# Altium schematic sheet InductorLadder.SchDoc
size A4
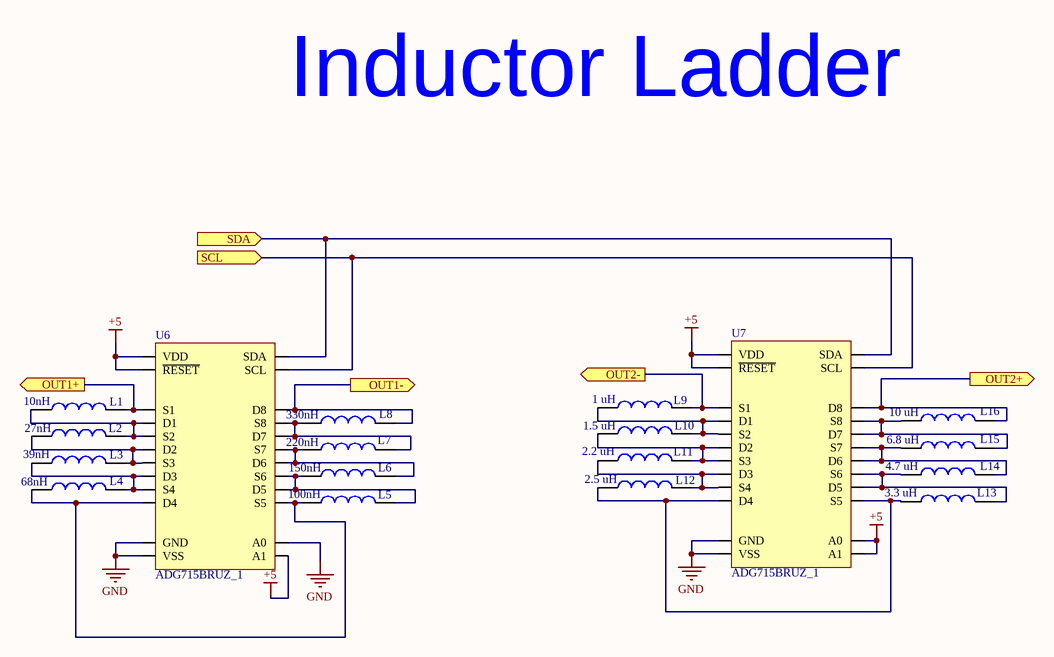
[diagram p0: InductorLadder.SchDoc]

## Parts
L1  value 10nH  [WE-KI_1008A]  (hidden comment: WE-KI, 744762110A)
L2  value 27nH  [WE-KI_1008A]  (hidden comment: WE-KI, 744762127A)
L3  value 39nH  [WE-KI_1008A]  (hidden comment: WE-KI, 744762139A)
L4  value 68nH  [WE-KI_1008A]  (hidden comment: WE-KI, 744762168A)
L5  value 100nH  [WE-KI_1008A]  (hidden comment: WE-KI, 744762210A)
L6  value 150nH  [WE-KI_1008A]  (hidden comment: WE-KI, 744762215A)
L7  value 220nH  [WE-KI_1008A]  (hidden comment: WE-KI, 744762222A)
L8  value 330nH  [WE-KI_1008A]  (hidden comment: WE-KI, 744762233A)
L9  1 uH  [WE-LQS_2010]
L10  1.5 uH  [WE-LQS_2010]
L11  2.2 uH  [WE-LQS_2010]
L12  2.5 uH  [WE-LQS_2010]
L13  3.3 uH  [WE-LQS_2010]
L14  4.7 uH  [WE-LQS_2010]
L15  6.8 uH  [WE-LQS_2010]
L16  10 uH  [WE-LQS_2010]
U6  ADG715BRUZ_1  [ADG715BRUZ]
U7  ADG715BRUZ_1  [ADG715BRUZ]

## Ports
OUT1+ (out), OUT1- (out), OUT2+ (out), OUT2- (out), SCL (in), SDA (in)

## Nets
+5: U6.2(VDD) U6.22(A1) U6.23(~{RESET}) U7.2(VDD) U7.22(A1) U7.23(~{RESET}) U7.24(A0)
GND: U6.4(GND) U6.21(VSS) U6.24(A0) U7.4(GND) U7.21(VSS)
OUT1+: L1.2 U6.5(S1) ; port OUT1+
OUT1-: L8.2 U6.19(D8) ; port OUT1-
OUT2+: L16.2 U7.19(D8) ; port OUT2+
OUT2-: L9.2 U7.5(S1) ; port OUT2-
SCL: U6.1(SCL) U7.1(SCL) ; port SCL
SDA: U6.3(SDA) U7.3(SDA) ; port SDA
NetL1_1: L1.1 L2.2 U6.6(D1) U6.7(S2)
NetL2_1: L2.1 L3.2 U6.8(D2) U6.9(S3)
NetL3_1: L3.1 L4.2 U6.10(D3) U6.11(S4)
NetL4_1: L4.1 L5.1 U6.12(D4) U6.14(S5)
NetL5_2: L5.2 L6.1 U6.13(D5) U6.16(S6)
NetL6_2: L6.2 L7.1 U6.15(D6) U6.18(S7)
NetL7_2: L7.2 L8.1 U6.17(D7) U6.20(S8)
NetL9_1: L9.1 L10.2 U7.6(D1) U7.7(S2)
NetL10_1: L10.1 L11.2 U7.8(D2) U7.9(S3)
NetL11_1: L11.1 L12.2 U7.10(D3) U7.11(S4)
NetL12_1: L12.1 L13.1 U7.12(D4) U7.14(S5)
NetL13_2: L13.2 L14.1 U7.13(D5) U7.16(S6)
NetL14_2: L14.2 L15.1 U7.15(D6) U7.18(S7)
NetL15_2: L15.2 L16.1 U7.17(D7) U7.20(S8)

## Notes on the sheet
- Inductor Ladder
- Title
- Size:
- Date:
- A4
- Number:
- Time:
- Revision:
- Sheet
- of
- File:

## Library data of the parts
L1 = WE-KI, 744762110A: WE-KI SMD Wire Wound Ceramic Inductor, size 1008A, 10nH; PublishedDate: Sep. 2016; Publisher: Wurth Elektronik; ComponentLink1Description: Manufacturer; ComponentLink1URL: http://www.we-online.de; ComponentLink2Description: Datasheet; ComponentLink2URL: http://katalog.we-online.de/pbs/datasheet/744762110A.pdf; PartNumber: 744762110A; Size: 1008A; Supplier 1: Digi-Key; Supplier Part Number 1: 732-1808-6-ND
L2 = WE-KI, 744762127A: WE-KI SMD Wire Wound Ceramic Inductor, size 1008A, 27nH; PublishedDate: Sep. 2016; Publisher: Wurth Elektronik; ComponentLink1Description: Manufacturer; ComponentLink1URL: http://www.we-online.de; ComponentLink2Description: Datasheet; ComponentLink2URL: http://katalog.we-online.de/pbs/datasheet/744762127A.pdf; PartNumber: 744762127A; Size: 1008A; Supplier 1: Digi-Key; Supplier Part Number 1: 732-1813-6-ND
L3 = WE-KI, 744762139A: WE-KI SMD Wire Wound Ceramic Inductor, size 1008A, 39nH; PublishedDate: Sep. 2016; Publisher: Wurth Elektronik; ComponentLink1Description: Manufacturer; ComponentLink1URL: http://www.we-online.de; ComponentLink2Description: Datasheet; ComponentLink2URL: http://katalog.we-online.de/pbs/datasheet/744762139A.pdf; PartNumber: 744762139A; Size: 1008A; Supplier 1: Digi-Key; Supplier Part Number 1: 732-1815-6-ND
L4 = WE-KI, 744762168A: WE-KI SMD Wire Wound Ceramic Inductor, size 1008A, 68nH; PublishedDate: Sep. 2016; Publisher: Wurth Elektronik; ComponentLink1Description: Manufacturer; ComponentLink1URL: http://www.we-online.de; ComponentLink2Description: Datasheet; ComponentLink2URL: http://katalog.we-online.de/pbs/datasheet/744762168A.pdf; PartNumber: 744762168A; Size: 1008A; Supplier 1: Digi-Key; Supplier Part Number 1: 732-1818-6-ND
L5 = WE-KI, 744762210A: WE-KI SMD Wire Wound Ceramic Inductor, size 1008A, 100nH; PublishedDate: Sep. 2016; Publisher: Wurth Elektronik; ComponentLink1Description: Manufacturer; ComponentLink1URL: http://www.we-online.de; ComponentLink2Description: Datasheet; ComponentLink2URL: http://katalog.we-online.de/pbs/datasheet/744762210A.pdf; PartNumber: 744762210A; Size: 1008A; Supplier 1: Digi-Key; Supplier Part Number 1: 732-1820-6-ND
L6 = WE-KI, 744762215A: WE-KI SMD Wire Wound Ceramic Inductor, size 1008A, 150nH; PublishedDate: Sep. 2016; Publisher: Wurth Elektronik; ComponentLink1Description: Manufacturer; ComponentLink1URL: http://www.we-online.de; ComponentLink2Description: Datasheet; ComponentLink2URL: http://katalog.we-online.de/pbs/datasheet/744762215A.pdf; PartNumber: 744762215A; Size: 1008A; Supplier 1: Digi-Key; Supplier Part Number 1: 732-1822-6-ND
L7 = WE-KI, 744762222A: WE-KI SMD Wire Wound Ceramic Inductor, size 1008A, 220nH; PublishedDate: Sep. 2016; Publisher: Wurth Elektronik; ComponentLink1Description: Manufacturer; ComponentLink1URL: http://www.we-online.de; ComponentLink2Description: Datasheet; ComponentLink2URL: http://katalog.we-online.de/pbs/datasheet/744762222A.pdf; PartNumber: 744762222A; Size: 1008A; Supplier 1: Digi-Key; Supplier Part Number 1: 732-1824-6-ND
L8 = WE-KI, 744762233A: WE-KI SMD Wire Wound Ceramic Inductor, size 1008A, 330nH; PublishedDate: Sep. 2016; Publisher: Wurth Elektronik; ComponentLink1Description: Manufacturer; ComponentLink1URL: http://www.we-online.de; ComponentLink2Description: Datasheet; ComponentLink2URL: http://katalog.we-online.de/pbs/datasheet/744762233A.pdf; PartNumber: 744762233A; Size: 1008A; Supplier 1: Digi-Key; Supplier Part Number 1: 732-1826-6-ND
L9 = 74404020010: WE-LQS SMD Power Inductor, size 2010, 1 uH, 1.49 A; Manufacturer: Wurth Electronics; Rated Current max.: 1.49 A; DC Resistance: 0.095 Ohm; ComponentLink1Description: Manufacturer; ComponentLink1URL: http://www.we-online.de; ComponentLink2Description: Datasheet; ComponentLink2URL: http://katalog.we-online.de/pbs/datasheet/74404020010.pdf; Part Number: 74404020010; Published Date: Dec. 2017; Publisher: Wurth Elektronik; Size: 2010; Inductance: 1 uH; Operating Temperature: -40 to +125 degC; Supplier 1: Digi-Key; Manufacturer Part Number: 74404020010; Stock 1: 3959; Supplier Part Number 1: 732-10739-6-ND; Pricing 1: 1=0.56, 50=0.4698, 100=0.357, 1000=0.31007 (USD)
L10 = 74404020015: WE-LQS SMD Power Inductor, size 2010, 1.5 uH, 1.19 A; Manufacturer: Wurth Electronics; Rated Current max.: 1.19 A; DC Resistance: 0.145 Ohm; ComponentLink1Description: Manufacturer; ComponentLink1URL: http://www.we-online.de; ComponentLink2Description: Datasheet; ComponentLink2URL: http://katalog.we-online.de/pbs/datasheet/74404020015.pdf; Part Number: 74404020015; Published Date: Dec. 2017; Publisher: Wurth Elektronik; Size: 2010; Inductance: 1.5 uH; Operating Temperature: -40 to +125 degC; Supplier 1: Digi-Key; Manufacturer Part Number: 74404020015; Stock 1: 3931; Supplier Part Number 1: 732-10740-6-ND; Pricing 1: 1=0.56, 50=0.4698, 100=0.357, 1000=0.31007 (USD)
L11 = 74404020022: WE-LQS SMD Power Inductor, size 2010, 2.2 uH, 0.96 A; Manufacturer: Wurth Electronics; Rated Current max.: 0.96 A; DC Resistance: 0.22 Ohm; ComponentLink1Description: Manufacturer; ComponentLink1URL: http://www.we-online.de; ComponentLink2Description: Datasheet; ComponentLink2URL: http://katalog.we-online.de/pbs/datasheet/74404020022.pdf; Part Number: 74404020022; Published Date: Dec. 2017; Publisher: Wurth Elektronik; Size: 2010; Inductance: 2.2 uH; Operating Temperature: -40 to +125 degC; Supplier 1: Digi-Key; Manufacturer Part Number: 74404020022; Stock 1: 3236; Supplier Part Number 1: 732-10741-6-ND; Pricing 1: 1=0.56, 50=0.4698, 100=0.357, 1000=0.31007 (USD)
L12 = 74405020022: WE-LQS SMD Power Inductor, size 2010, 2.5 uH, 0.96 A; Part Number: 74404020022; Manufacturer: Wurth Electronics; Rated Current max.: 0.96 A; Inductance: 2.2 uH; DC Resistance: 0.22 Ohm; ComponentLink1Description: Manufacturer; ComponentLink1URL: http://www.we-online.de; ComponentLink2Description: Datasheet; ComponentLink2URL: http://katalog.we-online.de/pbs/datasheet/74404020022.pdf; Published Date: Dec. 2017; Publisher: Wurth Elektronik; Size: 2010; Operating Temperature: -40 to +125 degC; Manufacturer Part Number: 74404020022; Supplier 1: Digi-Key; Stock 1: 4000; Supplier Part Number 1: 732-10770-6-ND; Pricing 1: 1=0.63, 50=0.522, 100=0.3967, 1000=0.34451 (USD)
L13 = 74404020033: WE-LQS SMD Power Inductor, size 2010, 3.3 uH, 0.87 A; Manufacturer: Wurth Electronics; Rated Current max.: 0.87 A; DC Resistance: 0.279 Ohm; ComponentLink1Description: Manufacturer; ComponentLink1URL: http://www.we-online.de; ComponentLink2Description: Datasheet; ComponentLink2URL: http://katalog.we-online.de/pbs/datasheet/74404020033.pdf; Part Number: 74404020033; Published Date: Dec. 2017; Publisher: Wurth Elektronik; Size: 2010; Inductance: 3.3 uH; Operating Temperature: -40 to +125 degC; Supplier 1: Digi-Key; Manufacturer Part Number: 74404020033; Stock 1: 3787; Supplier Part Number 1: 732-10742-6-ND; Pricing 1: 1=0.56, 50=0.4698, 100=0.357, 1000=0.31007 (USD)
L14 = 74404020047: WE-LQS SMD Power Inductor, size 2010, 4.7 uH, 0.73 A; Manufacturer: Wurth Electronics; Rated Current max.: 0.73 A; DC Resistance: 0.399 Ohm; ComponentLink1Description: Manufacturer; ComponentLink1URL: http://www.we-online.de; ComponentLink2Description: Datasheet; ComponentLink2URL: http://katalog.we-online.de/pbs/datasheet/74404020047.pdf; Part Number: 74404020047; Published Date: Dec. 2017; Publisher: Wurth Elektronik; Size: 2010; Inductance: 4.7 uH; Operating Temperature: -40 to +125 degC; Supplier 1: Digi-Key; Manufacturer Part Number: 74404020047; Stock 1: 3398; Supplier Part Number 1: 732-10743-6-ND; Pricing 1: 1=0.56, 50=0.4698, 100=0.357, 1000=0.31007 (USD)
L15 = 74404020068: WE-LQS SMD Power Inductor, size 2010, 6.8 uH, 0.56 A; Manufacturer: Wurth Electronics; Rated Current max.: 0.56 A; DC Resistance: 0.68 Ohm; ComponentLink1Description: Manufacturer; ComponentLink1URL: http://www.we-online.de; ComponentLink2Description: Datasheet; ComponentLink2URL: http://katalog.we-online.de/pbs/datasheet/74404020068.pdf; Part Number: 74404020068; Published Date: Dec. 2017; Publisher: Wurth Elektronik; Size: 2010; Inductance: 6.8 uH; Operating Temperature: -40 to +125 degC; Supplier 1: Digi-Key; Manufacturer Part Number: 74404020068; Stock 1: 3558; Supplier Part Number 1: 732-10744-6-ND; Pricing 1: 1=0.56, 50=0.4698, 100=0.357, 1000=0.31007 (USD)
L16 = 74404020100: WE-LQS SMD Power Inductor, size 2010, 10 uH, 0.5 A; Manufacturer: Wurth Electronics; Rated Current max.: 0.5 A; DC Resistance: 0.85 Ohm; ComponentLink1Description: Manufacturer; ComponentLink1URL: http://www.we-online.de; ComponentLink2Description: Datasheet; ComponentLink2URL: http://katalog.we-online.de/pbs/datasheet/74404020100.pdf; Part Number: 74404020100; Published Date: Dec. 2017; Publisher: Wurth Elektronik; Size: 2010; Inductance: 10 uH; Operating Temperature: -40 to +125 degC; Supplier 1: Digi-Key; Manufacturer Part Number: 74404020100; Stock 1: 3185; ComponentLink3URL: http://www.farnell.com/datasheets/2277209.pdf; ComponentLink3Description: http://www.farnell.com/datasheets/2277209.pdf; Supplier Part Number 1: 732-10745-6-ND; Pricing 1: 1=0.56, 50=0.4698, 100=0.357, 1000=0.31007 (USD)
U6 U7 = ADG715BRUZ_1: ANALOG DEVICES         ADG715BRUZ            Analogue Switch, Octal Channel, SPST, 8 Channels, 4.5 ohm, 2.7V to 5.5V, TSSOP, 24 Pins; Number of Channels: 8; Bandwidth: 155MHz; Drain to Source Resistance: 2.5R; Nominal Supply Current: 20uA; Max Power Dissipation: 125uW; Interface: Serial; Dual Supply Voltage: 2.5V; On-State Resistance: 4.5R; Turn-On Delay Time: 140ns; Turn-Off Delay Time: 130ns; Operating Supply Current: 10uA; High Level Output Current: 30mA; Supply Type: Single,Dual; Max Dual Supply Voltage: 2.75V; Min Dual Supply Voltage: 2.25V; Supplier 1: Digi-Key; Manufacturer: Analog Devices; Manufacturer Part Number: ADG715BRUZ; Stock 1: 3027; Case/Package: TSSOP; Number of Pins: 24; Contact Plating: Tin,Matte; Min Operating Temperature: -40°C; Max Operating Temperature: 85°C; Throw Configuration: SPST; Number of Bits: 8; Min Supply Voltage: 2.7V; Max Supply Voltage: 5.5V; Number of Inputs: 8; Number of Outputs: 8; Package Quantity: 62; Packaging: Rail/Tube; Number of Circuits: 8; -3db Bandwidth: 155MHz; Max Supply Current: 20uA; Power Dissipation: 125uW; Length: 7.8mm; Height: 1.05mm; Width: 4.4mm; Radiation Hardening: No; REACH SVHC: No SVHC; Lead Free: Contains Lead; ComponentLink1URL: https://datasheet.ciiva.com/2978/adg714-715-2978656.pdf; ComponentLink1Description: https://datasheet.ciiva.com/2978/adg714-715-2978656.pdf; ComponentLink2URL: https://datasheet.ciiva.com/1668/adg714-715-1668978.pdf; ComponentLink2Description: https://datasheet.ciiva.com/1668/adg714-715-1668978.pdf; ComponentLink3URL: https://datasheet.ciiva.com/15127/getdatasheetpartid-123058-15127194.pdf; ComponentLink3Description: https://datasheet.ciiva.com/15127/getdatasheetpartid-123058-15127194.pdf; ComponentLink4URL: https://datasheet.ciiva.com/16637/adg714-715-16637994.pdf; ComponentLink4Description: https://datasheet.ciiva.com/16637/adg714-715-16637994.pdf; ComponentLink5URL: https://datasheet.ciiva.com/5797/adg714-715-5797179.pdf; ComponentLink5Description: https://datasheet.ciiva.com/5797/adg714-715-5797179.pdf; ComponentLink6URL: https://datasheet.ciiva.com/48708/001248020-da-01-en-ic-switch-octal-adg715bruz-tssop-24-adi-48708535.pdf; ComponentLink6Description: https://datasheet.ciiva.com/48708/001248020-da-01-en-ic-switch-octal-adg715bruz-tssop-24-adi-48708535.pdf; Supplier Part Number 1: ADG715BRUZ-ND; Pricing 1: 1=6.12, 62=5.19758, 124=4.50452, 558=3.83461, 1054=3.234 (USD)